# EAGLE design kolrs868_tx_1.4 (EAGLE 6.4)
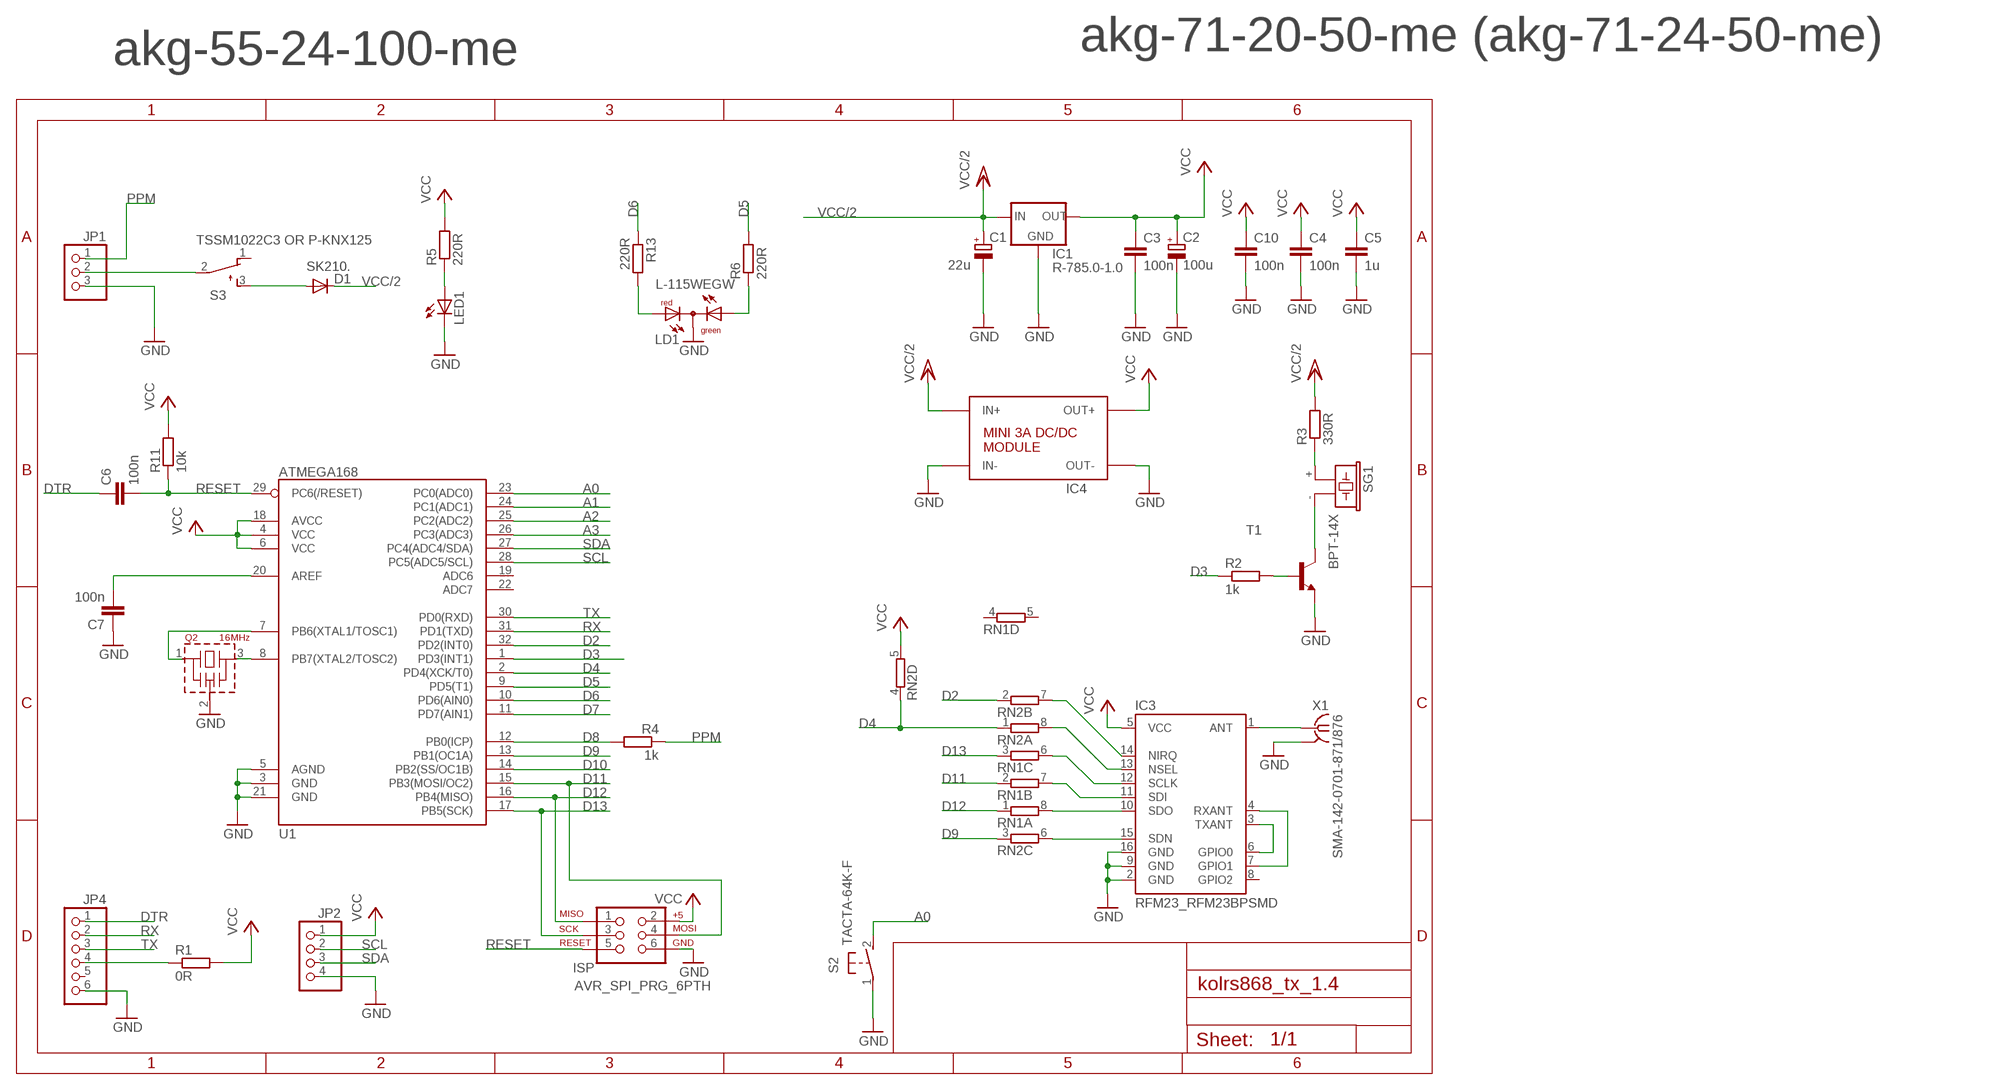
[diagram p0: schematic, sheet 1]

## Parts
C1  22u  CPOL-EUSMCB  [SMC_B]
C2  100u  CPOL-EUSMCB  [SMC_B]
C3  100n  C-EU_KOLIN  [M0805]
C4  100n  C-EU_KOLIN  [M0805]
C5  1u  C-EUC1206  [C1206]
C6  100n  C-EU_KOLIN  [M0805]
C7  100n  C-EU_KOLIN  [M0805]
C10  100n  C-EU_KOLIN  [M0805]
D1  SK210.  DIODE-SMB  [SMB]
IC1  R-785.0-1.0  78XX_RECOM  [78XX_RECOM]
IC3  RFM23_RFM23BPSMD  [RFM23_RFM23BP-S2]
IC4  MINI_3A_DCDC  [MINI_3A_DCDC]
ISP  AVR_SPI_PRG_6PTH  [2X3]
JP1  PINHD-1X3  [1X03]
JP2  PINHD-1X4  [1X04]
JP4  PINHD-1X6  [1X06]
LD1  L-115WEGW  DUOLED-RG-C  [DUOLED-C-5MM]
LED1  LEDCHIPLED_1206  [CHIPLED_1206]
Q2  16MHz  CSTLS_G  [CSTLS_G8]
R1  0R  R-EU_KOLINM0805  [M0805]
R2  1k  R-EU_KOLINM0805  [M0805]
R3  330R  R-EU_KOLINM0805  [M0805]
R4  1k  R-EU_KOLINM0805  [M0805]
R5  220R  R-EU_KOLINM0805  [M0805]
R6  220R  R-EU_KOLINM0805  [M0805]
R11  10k  R-EU_KOLINM0805  [M0805]
R13  220R  R-EU_KOLINM0805  [M0805]
RN1  4R-NCAY16  [CAY16]
RN2  4R-NCAY16  [CAY16]
S2  TACTA-64K-F  31-XX  [B3F-31XX]
S3  TSSM1022C3 OR P-KNX125  TL32WO  [TL3XWO]
SG1  BPT-14X  F/CM12P  [F/CM12P]
T1  BC848-NPN-SOT23-BEC  [SOT23-BEC]
U1  ATMEGA168  [TQFP32-08]
X1  SMA-142-0701-871/876  [J502-ND-142-0701-871/876]

## Nets
A0: S2.2(S) U1.23(PC0(ADC0))
A1: U1.24(PC1(ADC1))
A2: U1.25(PC2(ADC2))
A3: U1.26(PC3(ADC3))
D2: RN2.2 U1.32(PD2(INT0))
D3: R2.1 U1.1(PD3(INT1))
D4: RN2.1 RN2.4 U1.2(PD4(XCK/T0))
D5: R6.2 U1.9(PD5(T1))
D6: R13.1 U1.10(PD6(AIN0))
D7: U1.11(PD7(AIN1))
D8: R4.2 U1.12(PB0(ICP))
D9: RN2.3 U1.13(PB1(OC1A))
D10: U1.14(PB2(SS/OC1B))
D11: ISP.4 RN1.2 U1.15(PB3(MOSI/OC2))
D12: ISP.1 RN1.1 U1.16(PB4(MISO))
D13: ISP.3 RN1.3 U1.17(PB5(SCK))
DTR: C6.1 JP4.1
GND: C1.- C2.- C3.2 C4.2 C5.2 C7.1 C10.2 IC1.GND IC3.2(GND) IC3.9(GND) IC3.16(GND) IC4.1(IN-) IC4.2(IN-) IC4.7(OUT-) IC4.8(OUT-) ISP.6 JP1.3 JP2.4 JP4.6 LD1.C LED1.C Q2.2(VSS) S2.1(P) T1.E U1.3(GND) U1.5(AGND) U1.21(GND) X1.G@1(GND)
N$1: C7.2 U1.20(AREF)
N$2: IC3.3(TXANT) IC3.6(GPIO0)
N$3: IC3.4(RXANT) IC3.7(GPIO1)
N$4: IC3.1(ANT) X1.1
N$5: LD1.AR R13.2
N$6: Q2.1 U1.7(PB6(XTAL1/TOSC1))
N$7: Q2.3 U1.8(PB7(XTAL2/TOSC2))
N$8: LD1.AX(AG) R6.1
N$9: D1.A S3.3(S)
N$10: R2.2 T1.B
N$11: SG1.- T1.C
N$12: R3.1 SG1.+
N$13: JP1.2 S3.2(P)
N$14: LED1.A R5.1
N$15: JP4.4 R1.1
N$16: IC3.10(SDO) RN1.8
N$17: IC3.11(SDI) RN1.7
N$18: IC3.12(SCLK) RN1.6
N$19: IC3.15(SDN) RN2.6
N$20: IC3.13(NSEL) RN2.8
N$21: IC3.14(NIRQ) RN2.7
PPM: JP1.1 R4.1
RESET: C6.2 ISP.5 R11.1 U1.29(PC6(/RESET))
RX: JP4.2 U1.31(PD1(TXD))
SCL: JP2.2 U1.28(PC5(ADC5/SCL))
SDA: JP2.3 U1.27(PC4(ADC4/SDA))
TX: JP4.3 U1.30(PD0(RXD))
VCC: C2.+ C3.1 C4.1 C5.1 C10.1 IC1.OUT IC3.5(VCC) IC4.5(OUT+) IC4.6(OUT+) ISP.2 JP2.1 R1.2 R5.2 R11.2 RN2.5 U1.4(VCC) U1.6(VCC) U1.18(AVCC)
VCC/2: C1.+ D1.C IC1.IN IC4.3(IN+) IC4.4(IN+) R3.2
Unconnected: IC3.8(GPIO2) JP4.5 RN1.4 RN1.5 S3.1(O) U1.19(ADC6) U1.22(ADC7)

## Notes on the sheet
- akg-55-24-100-me | akg-71-20-50-me (akg-71-24-50-me)

## Power pins joined to a net without a drawn wire
GND: X1.G@2(GND) X1.G@3(GND) X1.G@4(GND)

## Library data of the parts
C1 C2 = rcl:CPOL-EU: POLARIZED CAPACITOR, European symbol
C3 C4 C6 C7 C10 = PINHEAD_RC:C-EU_KOLIN: CAPACITOR, European symbol
C5 = rcl:C-EU: CAPACITOR, European symbol
D1 = diode:DIODE-: DIODE
IC1 = recom:78XX_RECOM: VOLTAGE REGULATOR
IC3 = openLRSngTX:RFM23_RFM23BP: The RFM23BP is a medium power, low cost radio that is capable of operating in the 434MHz and 900MHz open bands. It s frequency is software defined and there are some very good libraries written for it.'
IC4 = mini_3A_dcdc:MINI_3A_DCDC
ISP = SparkFun:AVR_SPI_PRG_6: AVR ISP 6 Pin This is the reduced ISP connector for AVR programming. Common on Arduino. This footprint will take up less PCB space and can be used with a 10-pin to 6-pin adapter such as SKU: BOB-08508
JP1 = pinhead:PINHD-1X3: PIN HEADER
JP2 = pinhead:PINHD-1X4: PIN HEADER
JP4 = pinhead:PINHD-1X6: PIN HEADER
LD1 = led:DUOLED-RG-C: DUO LED 2 colors (red/green), 5 mm, round, common Cathode www.ligitek.com or other producers.
LED1 = led:LED: LED OSRAM: - CHIPLED LG R971, LG N971, LY N971, LG Q971, LY Q971, LO R971, LY R971 LH N974, LH R974 LS Q976, LO Q976, LY Q976 LO Q996 - Hyper CHIPLED LW Q18S LB Q993, LB Q99A, LB R99A - SideLED LS A670, LO A670, LY A670, LG A670, LP A670 LB A673, LV A673, LT A673, LW A673 LH A674 LY A675 LS A676, LA A676, LO A676, LY A676, LW A676 LS A679, LY A679, LG A679 - Hyper Micro SIDELED® LS Y876, LA Y876, LO Y876, LY Y876 LT Y87S - SmartLED LW L88C, LW L88S LB L89C, LB L89S, LG L890 LS L89K, LO L89K, LY L89K LS L896, LA L896, LO L896, LY L896 - TOPLED LS T670, LO T670, LY T670, LG T670, LP T670 LSG T670, LSP T670, LSY T670, LOP T670, LYG T670 LG T671, LOG T671, LSG T671 LB T673, LV T673, LT T673, LW T673 LH T674 LS T676, LA T676, LO T676, LY T676, LB T676, LH T676, LSB T676, LW T676 LB T67C, LV T67C, LT T67C, LS T67K, LO T67K, LY T67K, LW E67C LS E67B, LA E67B, LO E67B, LY E67B, LB E67C, LV E67C, LT E67C LW T67C LS T679, LY T679, LG T679 LS T770, LO T770, LY T770, LG T770, LP T770 LB T773, LV T773, LT T773, LW T773 LH T774 LS E675, LA E675, LY E675, LS T675 LS T776, LA T776, LO T776, LY T776, LB T776 LHGB T686 LT T68C, LB T68C - Hyper Mini TOPLED® LB M676 - Mini TOPLED Santana® LG M470 LS M47K, LO M47K, LY M47K Source: http://www.osram.convergy.de LUXEON: - LUMILED® LXK2-PW12-R00, LXK2-PW12-S00, LXK2-PW14-U00, LXK2-PW14-V00 LXK2-PM12-R00, LXK2-PM12-S00, LXK2-PM14-U00 LXK2-PE12-Q00, LXK2-PE12-R00, LXK2-PE12-S00, LXK2-PE14-T00, LXK2-PE14-U00 LXK2-PB12-K00, LXK2-PB12-L00, LXK2-PB12-M00, LXK2-PB14-N00, LXK2-PB14-P00, LXK2-PB14-Q00 LXK2-PR12-L00, LXK2-PR12-M00, LXK2-PR14-Q00, LXK2-PR14-R00 LXK2-PD12-Q00, LXK2-PD12-R00, LXK2-PD12-S00 LXK2-PH12-R00, LXK2-PH12-S00 LXK2-PL12-P00, LXK2-PL12-Q00, LXK2-PL12-R00 Source: www.luxeon.com KINGBRIGHT: KA-3528ASYC Source: www.kingbright.com
Q2 = murata-resonators:CSTLS_G: Ceramic resonator 2.00 to 10.00 MHz
R1-R6 R11 R13 = PINHEAD_RC:R-EU_KOLIN: RESISTOR, European symbol
RN1 RN2 = resistor-dil:4R-N: Array Chip Resistor Source: RS Component / Phycomp; OC_FARNELL: unknown; OC_NEWARK: unknown
S2 = switch-omron:31-XX: OMRON SWITCH; MPN: B3F-3100; OC_FARNELL: 959704; OC_NEWARK: 36M3582
S3 = switch:TL32WO: TINY SWITCH ON - MOM Source: http://www2.produktinfo.conrad.com/datenblaetter/700000-724999/705152-da-01-de-Subminiaturschalter_TL_36WO.pdf
SG1 = buzzer:F/CM12P: BUZZER Source: Buerklin; OC_FARNELL: unknown; OC_NEWARK: unknown
T1 = transistor:*-NPN-: NPN Transistror BF959 corrected 2008.03.06
U1 = SparkFun:ATMEGA168
X1 = con-coax:SMA-: SMA 50 Ohm End Launch Jack Receptacle - Round Contact Johnson Components Source: www.johnsoncomponents.com .. J502-ND.pdf; MF: JOHNSON COMPONENTS; MPN: 142-0701-871; OC_FARNELL: 1339835; OC_NEWARK: 91B6105

## Board
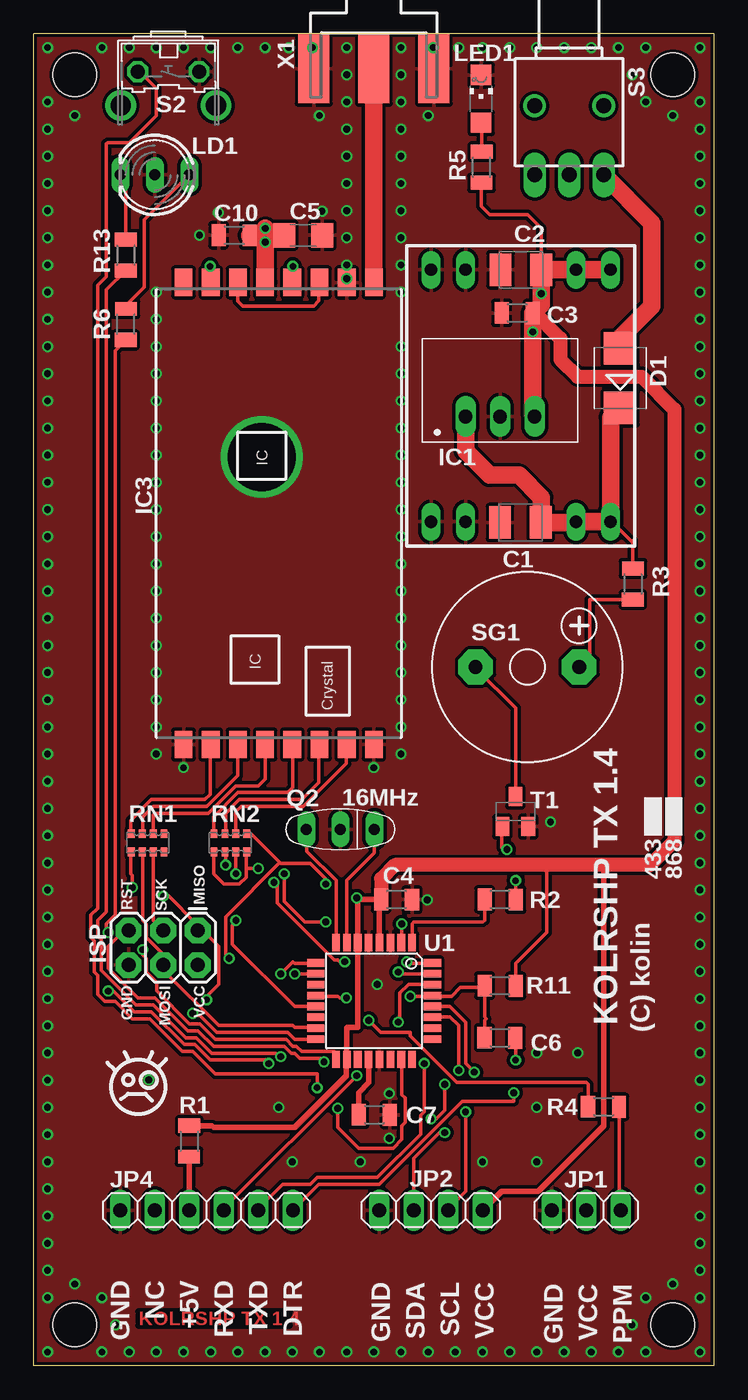
[diagram p1: board, top side]
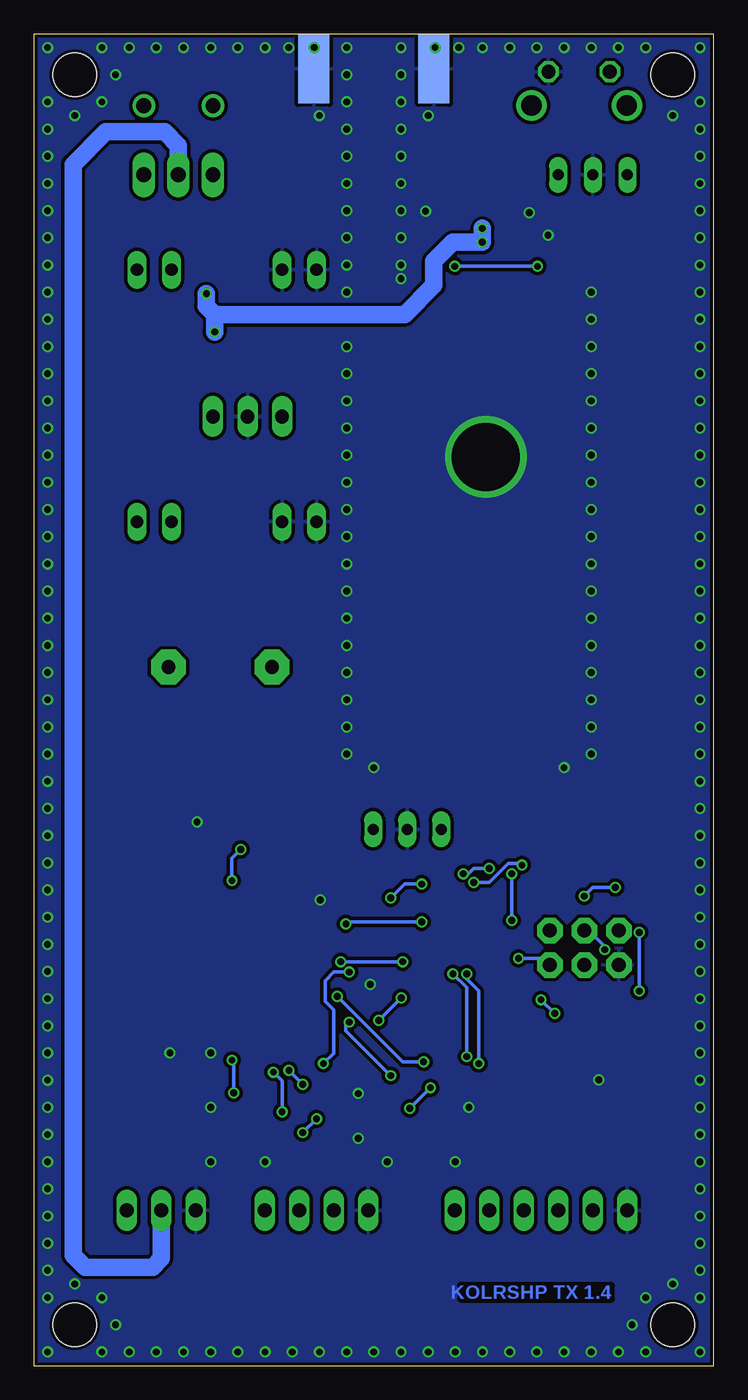
[diagram p2: board, bottom side, seen from below]

Size 50 x 98 mm. Coordinates in mm from the lower left corner, seen from the top.
Outline: 50,98 0,98 0,0 50,0 50,98
Copper layers (1*16): Top 0.035mm / dielectric 1.5mm / Bottom 0.035mm
Design rules "ITEADstudio_DRC *": minimum track width 6mil, minimum drill 11mil, track to track 6mil, track to pad 6mil, pad to pad 6mil, via to via 6mil, smd to smd 0mil, copper to edge 10mil, drill to drill 10mil, minimum pad ring 10mil, minimum via ring 6mil, stop-mask expansion 2mil, vias tented up to drill 100mil, thermal gap 10mil
Holes 3.2 mm at 3,95 47,95 47,3 3,3

### Footprints (pad centres in the part's own frame; a part is rotated, then mirrored left to right if it is on the bottom)
SMC_B = smd 1.6 x 2.4: + -1.5,0; - 1.5,0
M0805 = smd 1.021 x 1.6: 1 -1.131,0.017 | smd 1.046 x 1.6: 2 1.148,0
C1206 = smd 1.6 x 1.8: 1 -1.4,0; 2 1.4,0
SMB = smd 2.4 x 2.4: A 2.2,0; C -2.2,0
78XX_RECOM = drill 1.016 long: GND 0,-2.54; IN -2.54,-2.54; OUT 2.54,-2.54
RFM23_RFM23BP-S2 = smd 2 x 1.3: 1 -17,7; 2 -17,5; 3 -17,3; 4 -17,1; 5 -17,-1; 6 -17,-3; 7 -17,-5; 8 -17,-7; 9 17,-7; 10 17,-5; 11 17,-3; 12 17,-1; 13 17,1; 14 17,3; 15 17,5; 16 17,7
MINI_3A_DCDC = drill 0.9 long: 1 -9.017,6.35; 2 -9.017,3.81; 3 -9.017,-4.318; 4 -9.017,-6.858; 5 9.525,-6.858; 6 9.525,-4.318; 7 9.525,3.81; 8 9.525,6.35
2X3 = drill 1.016 pad 1.88 octagon: 1 0,0; 2 0,2.54; 3 2.54,0; 4 2.54,2.54; 5 5.08,0; 6 5.08,2.54
1X03 = drill 1.016 long: 1 -2.54,0; 2 0,0; 3 2.54,0
1X04 = drill 1.016 long: 1 -3.81,0; 2 -1.27,0; 3 1.27,0; 4 3.81,0
1X06 = drill 1.016 long: 1 -6.35,0; 2 -3.81,0; 3 -1.27,0; 4 1.27,0; 5 3.81,0; 6 6.35,0
DUOLED-C-5MM = drill 0.813 long: AR 2.54,0; AX -2.54,0; C 0,0
CHIPLED_1206 = smd 1.5 x 1.5: A 0,-1.75; C 0,1.75
CSTLS_G8 = drill 0.813 long: 1 -2.5,0; 2 0,0; 3 2.5,0
CAY16 = smd 0.5 x 0.65: 1 -1.2,-0.675; 2 -0.4,-0.675; 3 0.4,-0.675; 4 1.2,-0.675; 5 1.2,0.675; 6 0.4,0.675; 7 -0.4,0.675; 8 -1.2,0.675
B3F-31XX = drill 1.016 octagon: 1 -2.261,-1.245; 2 2.261,-1.245 | drill 1.499 pad 2.159: 3 -3.505,1.245; 4 3.505,1.245
TL3XWO = drill 1.1 pad 1.422 long: 1 -2.54,-5.08; 2 0,-5.08; 3 2.54,-5.08 | drill 1.1 pad 1.676: M1 -2.54,0; M2 2.54,0
F/CM12P = drill 1.016 pad 2.54 octagon: + 3.81,0; - -3.81,0
SOT23-BEC = smd 1 x 1.4: B -0.95,-1.1; C 0,1.1; E 0.95,-1.1
TQFP32-08 = smd 1.27 x 0.559: 1 -4.293,2.8; 2 -4.293,2; 3 -4.293,1.2; 4 -4.293,0.4; 5 -4.293,-0.4; 6 -4.293,-1.2; 7 -4.293,-2; 8 -4.293,-2.8; 17 4.293,-2.8; 18 4.293,-2; 19 4.293,-1.2; 20 4.293,-0.4; 21 4.293,0.4; 22 4.293,1.2; 23 4.293,2; 24 4.293,2.8 | smd 0.559 x 1.27: 9 -2.8,-4.293; 10 -2,-4.293; 11 -1.2,-4.293; 12 -0.4,-4.293; 13 0.4,-4.293; 14 1.2,-4.293; 15 2,-4.293; 16 2.8,-4.293; 25 2.8,4.293; 26 2,4.293; 27 1.2,4.293; 28 0.4,4.293; 29 -0.4,4.293; 30 -1.2,4.293; 31 -2,4.293; 32 -2.8,4.293
J502-ND-142-0701-871/876 = smd 5.08 x 2.286: 1 2.565,0; G@1 2.565,4.42; G@2 2.565,-4.42 | smd 5.08 x 2.286 bottom: G@3 2.565,4.42; G@4 2.565,-4.42

### Placement (x,y rotation side)
C1  35.78,62.05 180 top
C2  35.81,80.64 180 top
C3  35.56,77.47 180 top
C4  26.67,34.29 0 top
C5  19.81,83.19 0 top
C6  34.29,24.13 180 top
C7  25.05,18.47 180 top
C10  14.73,83.19 180 top
D1  43.12,72.67 90 top
IC1  34.29,72.39 0 top
IC3  18.01,62.71 270 top
IC4  35.56,71.12 90 top
ISP  12.05,32.02 180 top
JP1  40.64,11.43 180 top
JP2  29.21,11.43 180 top
JP4  12.7,11.43 180 top
LD1  8.89,87.63 180 top
LED1  32.89,93.22 0 top
Q2  22.54,39.46 180 top
R1  11.43,16.51 90 top
R2  34.29,34.29 0 top
R3  44.06,57.51 90 top
R4  41.91,19.05 180 top
R5  32.92,88.19 270 top
R6  6.76,76.64 270 top
R11  34.29,27.94 0 top
R13  6.76,81.72 90 top
RN1  8.37,38.47 0 top
RN2  14.45,38.47 0 top
S2  9.89,93.98 180 top
S3  39.37,92.71 0 top
SG1  36.3,51.41 0 top
T1  35.41,40.77 0 top
U1  25.02,26.83 270 top
X1  25,98 270 top

### Tracks (layer width: path | path; a pad name or v marks a point on that pad's centre or on a via)
A0  (via drill 0.5)
  Top 0.254: v20.83,20.45 20.83,21.46 13.34,21.46 11.68,23.11 10.92,23.11 8.51,25.53 7.24,25.53 5.97,26.8 5.21,26.8 4.7,27.3 4.7,28.7 4.45,28.96 4.45,31.24 4.19,31.5 4.19,33.15 4.7,33.66 4.7,79.5 5.33,80.14 5.33,89.92 5.42,90 7,90 9,92 9,94 8,95 S2.2 | v22.35,18.92 22.35,17.53 23.88,16 26.42,16 27.05,16.64 27.05,17.65 27.3,17.91 27.3,19.68 27.05,19.94 27.05,22.48 U1.23
  Bottom 0.254: v22.35,18.92 v20.83,20.45
D2  (via drill 0.5)
  Top 0.254: v14.1,36.83 14.1,37.72 RN2.2 | 22.67,29.53 22.35,29.84 22.1,29.84 17.91,34.04 17.91,35.56 v17.65,35.56 | 22.67,29.53 22.73,29.46 | v27.43,29.72 27.56,29.59 29.21,29.59 U1.32 | 22.67,29.53 v22.86,29.72
  Bottom 0.254: v17.65,35.56 16.51,35.56 15.11,36.96 14.22,36.96 v14.1,36.83 | v22.86,29.72 v27.43,29.72
D3
  Top 0.254: U1.1 27.81,31.24 27.81,32.51 27.94,32.64 33.02,32.64 33.15,32.77 33.15,34.29 R2.1
D4  (via drill 0.5)
  Top 0.254: 15.62,36.58 15.62,35.94 15.11,35.43 13.97,35.43 13.21,36.2 13.21,37.72 RN2.1 | 15.62,36.58 15.62,37.72 RN2.4 | v21.46,32.64 19.94,32.64 18.41,34.16 v18.41,36.2 | 15.62,36.58 v16.51,36.58 | v27.05,32.51 27.05,31.24 U1.2
  Bottom 0.254: v18.41,36.2 18.03,36.2 17.65,36.58 v16.51,36.58 | v27.05,32.51 26.92,32.64 v21.46,32.64
D5  (via drill 0.5)
  Top 0.254: R6.2 5.97,74.7 5.97,33.15 5.33,32.51 5.33,31.88 | 5.33,31.88 5.33,31.75 | v17.27,22.23 17.4,22.23 17.14,22.48 12.95,22.48 11.81,23.62 11.05,23.62 8.64,26.04 7.37,26.04 5.84,27.56 v5.46,27.56 | v18.16,28.83 19.05,29.72 19.18,29.59 20.7,29.59 U1.9 | 5.33,31.88 v5.46,31.88
  Bottom 0.254: v17.27,22.23 17.27,27.56 18.16,28.45 v18.16,28.83 | v5.46,31.88 v5.46,27.56
D6  (via drill 0.5)
  Top 0.254: R13.1 5.33,79.18 5.33,33.4 4.7,32.77 4.7,31.62 4.95,31.37 4.95,29.08 7.49,26.54 8.76,26.54 11.18,24.13 11.94,24.13 13.08,22.99 17.78,22.99 18.16,22.61 v18.16,22.73 | v19.18,28.83 20.7,28.83 U1.10
  Bottom 0.254: v18.16,22.73 18.16,27.81 v19.18,28.83
D8  (via drill 0.5)
  Top 0.254: v24.64,25.4 25.53,24.51 27.69,24.51 27.69,24.26 31.11,20.83 40.64,20.83 40.77,20.7 R4.2 | v22.99,27.05 22.48,27.05 22.35,27.18 20.83,27.18 U1.12
  Bottom 0.254: v22.99,27.05 v24.64,25.4
D9  (via drill 0.5)
  Top 0.254: v14.86,32.77 14.86,32.64 14.61,32.38 14.61,30.99 19.18,26.42 20.7,26.42 U1.13 | v14.86,36.2 14.86,37.72 RN2.3
  Bottom 0.254: v14.86,36.2 v14.86,32.77
D11
  Top 0.254: RN1.2 8,37.72 8,32.77 8.26,32.51 8.26,31.5 9.4,30.35 9.4,29.59 ISP.4 9.53,29.46 9.53,29.08 13.59,25.02 19.05,25.02 19.18,24.89 20.7,24.89 U1.15
D12  (via drill 0.5)
  Top 0.254: U1.16 20.7,24 19.18,24 18.67,24.51 13.46,24.51 12.19,25.78 11.81,25.78 v11.68,25.91 | v12.7,26.92 12.7,27.18 13.59,28.07 13.59,30.86 12.45,32 12.06,32 ISP.1 11.94,32.13 11.94,32.51 9.91,34.54 v9.53,34.54 | v7.24,35.18 7.24,36.07 7.11,36.2 7.11,37.72 RN1.1
  Bottom 0.254: v12.7,26.92 v11.68,25.91 | v7.24,35.18 8.89,35.18 v9.53,34.54
D13  (via drill 0.5)
  Top 0.254: RN1.3 8.76,37.72 8.76,32.77 9.4,32.13 ISP.3 | U1.17 22.23,22.61 22.23,22.99 22.1,23.11 19.68,23.11 19.3,23.5 19.05,23.5 18.54,24 13.34,24 12.19,25.15 11.43,25.15 9.02,27.56 9.02,28.19 8.26,28.96 8.26,29.97 8,30.23 v8,30.61
  Bottom 0.254: v8,30.61 8,30.86 9.14,32 9.4,32 ISP.3
DTR  (via drill 0.5)
  Top 0.254: v35.31,20.07 35.31,19.43 31.5,19.43 25.4,13.34 20.95,13.34 JP4.1 | v35.43,22.48 35.43,24 C6.1
  Bottom 0.254: v35.31,20.07 35.31,22.35 v35.43,22.48
GND  (via drill 0.5, 5)
  other vias: 1,1 5,1 7,1 9,1 11,1 13,1 15,1 17,1 19,1 21,1 23,1 25,1 27,1 29,1 31,1 33,1 35,1 37,1 39,1 41,1 43,1 45,1 49,1 49,11 49,9 49,7 49,5 49,21 49,19 49,17 49,15 49,13 49,31 49,29 49,27 49,25 49,23 49,41 49,39 49,37 49,35 49,33 49,51 49,49 49,47 49,45 49,43 49,61 49,59 49,57 49,55 49,53 49,71 49,69 49,67 49,65 49,63 49,81 49,79 49,77 49,75 49,73 49,91 49,89 49,87 49,85 49,83 49,93 49,97 45,97 43,97 41,97 39,97 37,97 35,97 33,97 31.25,97 29.38,97 27,97 23,97 20.49,97 18.75,97 17,97 15,97 13,97 11,97 9,97 7,97 5,97 1,97 1,91 1,89 1,87 1,85 1,83 1,93 1,81 1,79 1,77 1,75 1,73 1,71 1,69 1,67 1,65 1,63 1,61 1,59 1,57 1,55 1,53 1,51 1,49 1,47 1,45 1,43 1,41 1,39 1,37 1,35 1,33 1,31 1,29 1,27 1,25 1,23 1,21 1,19 1,17 1,15 1,13 1,11 1,9 1,7 1,5 13.57,84.84 12.18,83.19 21.19,84.97 26.14,20.02 26.14,16.71 28.93,34.27 25.25,28.05 18,19 19,15 24,15 33,15 37,15 37,19 25,44 11,44 23,91 23,89 23,87 23,85 23,83 23,81 27,81 27,79 27,83 27,85 27,87 27,89 27,91 21,92 29,92 23,93 23,95 27,93 27,95 8.44,21.02 16.75,66.87 9,79 9,77 9,75 9,73 9,71 9,69 9,67 9,65 9,63 9,61 9,59 9,57 9,55 9,53 9,51 9,49 9,47 9,45 27,75 27,73 27,71 27,69 27,67 27,65 27,63 27,61 27,59 27,57 27,55 27,53 27,51 27,49 27,47 27,45 38,40 40,23 37,23 45,93 44,95 47,92 3,92 47,6 45,5 44,3 6,3 5,5 3,6 23,80
  pour Top (isolate 0.254): 0,0 50,0 50,98 0,98
  pour Bottom (isolate 0.254): 0,0 50,0 50,98 0,98
N$1
  Top 0.406: U1.20 24.64,22.48 24.64,20.83 23.88,20.07 23.88,18.54 C7.2
N$2
  Top 0.254: IC3.3 20.95,79.66 20.95,78.36 20.57,77.98 15.37,77.98 15.01,78.34 IC3.6
N$3  (via drill 0.5)
  Top 0.254: IC3.4 19.05,79.76 v19.05,80.9 | v12.95,80.9 13.01,80.85 IC3.7
  Bottom 0.254: v19.05,80.9 v12.95,80.9
N$4
  Top 1.27: IC3.1 X1.1
N$5
  Top 0.254: LD1.AR 6.76,87.22 R13.2
N$6
  Top 0.254: U1.7 23.02,35.72 25.04,37.74 Q2.1
N$7
  Top 0.254: Q2.3 20.07,37.85 22.23,35.69 22.23,31.24 U1.8
N$8
  Top 0.254: LD1.AX 8.13,84.33 8.13,79.38 6.78,78.02 R6.1
N$9
  Top 1.27: S3.3 45.47,84.07 45.47,77.98 43.12,75.64 D1.A
N$10  (via drill 0.5)
  Top 0.254: v35.43,35.69 R2.2 | v34.8,37.97 34.54,37.97 34.42,38.1 34.42,39.62 T1.B
  Bottom 0.254: v35.43,35.69 35.43,37.34 v34.8,37.97
N$11
  Top 0.254: T1.C 35.43,41.91 35.43,48.39 32.51,51.31 SG1.-
N$12
  Top 0.254: R3.1 40.89,56.39 40.89,52.2 40.13,51.44 SG1.+
N$13
  Bottom 1.27: JP1.2 40.64,7.87 41.27,7.24 46.23,7.24 47.12,8.13 47.12,88.39 44.7,90.81 40.39,90.81 39.37,89.79 S3.2
N$14
  Top 0.254: LED1.A 32.94,91.42 R5.1
N$15
  Top 0.254: 11.43,15.37 R1.1
  Top 0.406: JP4.4 11.43,15.37
N$16
  Top 0.254: RN1.8 7.11,39.24 7.11,40.13 8.64,41.66 12.57,41.66 12.95,42.04 12.95,45.59 IC3.10
N$17
  Top 0.254: IC3.11 14.99,45.59 14.99,43.43 12.7,41.15 8.76,41.15 8,40.39 8,39.24 RN1.7
N$18
  Top 0.254: RN1.6 8.76,39.24 8.76,40.51 8.89,40.64 12.83,40.64 14.86,42.67 16.51,42.67 17.02,43.18 17.02,45.59 IC3.12
N$19
  Top 0.254: RN2.6 14.86,39.24 14.86,40.77 15.24,41.15 19.81,41.15 22.99,44.32 22.99,45.59 IC3.15
N$20
  Top 0.254: RN2.8 13.21,39.24 13.21,40.39 14.99,42.16 18.67,42.16 19.05,42.55 19.05,45.59 IC3.13
N$21
  Top 0.254: RN2.7 14.1,39.24 14.1,40.64 15.11,41.66 19.68,41.66 20.95,42.93 20.95,45.59 IC3.14
PPM
  Top 0.254: JP1.1 43.05,11.56 43.05,18.92 R4.1
RESET  (via drill 0.5)
  Top 0.254: ISP.5 6.86,32 6.6,32 5.46,30.86 5.46,29.21 7.62,27.05 8.89,27.05 11.3,24.64 12.06,24.64 13.21,23.5 18.41,23.5 18.92,22.99 19.18,22.99 19.56,22.61 21.08,22.61 v21.34,22.35 | v27.69,27.18 29.21,27.18 U1.29 29.34,27.18 30.73,27.18 31.37,27.81 33.15,27.81 | 33.15,27.81 33.27,27.94 R11.1 33.15,27.81 | C6.2 33.15,25.4 33.27,25.53 33.15,25.65 33.15,27.81
  Bottom 0.254: v21.34,22.35 22.86,22.35 v27.69,27.18
RX  (via drill 0.5)
  Top 0.254: v28.7,22.23 28.7,18.67 28.45,18.41 28.45,17.02 25.27,13.84 20.83,13.84 20.32,13.34 18.29,13.34 16.51,11.56 JP4.2 | 29.21,28.83 U1.31 26.92,28.83 v26.8,28.96
  Bottom 0.254: v28.7,22.23 27.94,22.99 27.94,26.16 28.57,26.8 28.57,28.32 27.94,28.96 v26.8,28.96
SCL  (via drill 0.5)
  Top 0.254: v31.75,18.67 31.75,12.83 30.48,11.56 JP2.2 | v32.38,21.59 31.75,22.23 31.75,25.27 30.61,26.42 29.34,26.42 U1.28
  Bottom 0.254: 32.38,21.34 v32.38,21.59 31.75,20.95 v31.75,18.67
SDA  (via drill 0.5)
  Top 0.254: v30.23,17.14 29.84,17.14 27.94,15.24 JP2.3 | v31.24,21.72 31.24,25.02 30.61,25.65 29.34,25.65 U1.27 | v30.23,20.7 30.23,18.8 29.59,18.16 v29.21,18.16
  Bottom 0.254: v30.23,17.14 v29.21,18.16 | v30.23,20.7 v31.24,21.72
TX  (via drill 0.5)
  Top 0.254: 26.92,25.4 27.05,25.4 | v23.75,21.34 13.97,11.56 JP4.3 | 26.92,25.4 26.92,27.43 27.56,28.07 29.21,28.07 U1.30 | 26.92,25.4 v26.8,25.27
  Bottom 0.254: v26.8,25.27 27.05,25.02 27.05,24.64 v23.75,21.34
VCC  (via drill 0.5)
  Top 0.254: R5.2 32.89,87.02 32.89,85.34 33.53,84.71 36.32,84.71 37.31,83.72 C2.+ | 18.1,37.02 16,39.12 15.75,39.12 RN2.5 | 18.1,37.02 18.16,36.96 20.32,36.96 21.46,35.81 v21.46,35.43 | v23.75,34.42 23.82,34.31 | 18.1,37.02 14.1,33.02 14.1,29.97 v14.35,29.97 | R11.2 35.43,29.59 37.72,31.88 37.72,36.83
  Top 0.406: U1.4 25.42,34.19 C4.1 23.82,34.31 U1.6 23.82,24.89 23.11,24.89 arc90 23.02,24.8 U1.18 22.99,22.35 22.99,21.34 19.18,17.53 13.21,17.53 13.08,17.65 R1.2 | JP2.1 34.42,12.83 37.08,12.83 41.91,17.65 41.91,36.74 42,36.83 | R11.2
  Top 1.016: 36.78,77.55 38.73,75.6 38.73,74.04 40.01,72.77 44.7,72.77 47.12,70.36 47.12,38.61 45.34,36.83 42,36.83 37.72,36.83 26.54,36.83 25.54,35.83 C4.1
  Top 1.27: IC1.OUT 36.69,69.99 C3.1 36.78,77.55 37.31,78.08 v37.31,78.89 C2.+ IC4.6 IC4.5 | v17.02,83.69 17.02,83.19 | 17.02,83.19 v17.02,82.68 17.02,79.72 IC3.5 | C10.1 15.88,83.19 17.02,83.19 | C5.1 17.02,83.19
  Bottom 0.254: v21.46,35.43 22.73,35.43 v23.75,34.42 | v14.35,29.97 12.45,29.97 12.06,29.59 ISP.2
  Bottom 1.27: v37.31,78.89 37.34,78.86 37.34,77.98 36.7,77.34 36.7,77.22 | 36.7,77.22 v36.7,76.07 | 36.7,77.22 36.58,77.34 22.73,77.34 20.57,79.5 20.57,81.28 19.18,82.68 v17.02,82.68 v17.02,83.69
VCC/2
  Top 0.254: 44.07,60.58 44.07,58.8 44.2,58.67 44.07,58.55 R3.2 | 44.07,60.58 44.07,60.71 | 44.07,60.58 42.93,61.72 IC4.4
  Top 1.27: D1.C 42.42,69.77 IC4.4 IC4.3 39.82,62.05 C1.+ 37.34,62.1 37.34,63.88 35.69,65.53 33.53,65.53 31.75,67.31 IC1.IN

### Text on the board
Top: KOLRSHP TX 1.4
Bottom: KOLRSHP TX 1.4
tPlace: GND | SDA | SCL | VCC | 2-3 INV | JP3 PPM 1-2 NORM | KOLRSHP TX 1.4 | 433 | 868 | MISO | RST | SCK | (C) kolin | GND | MOSI | VCC | GND | NC | +5V | RXD | TXD | DTR | GND | SDA | SCL | VCC | GND | VCC | PPM